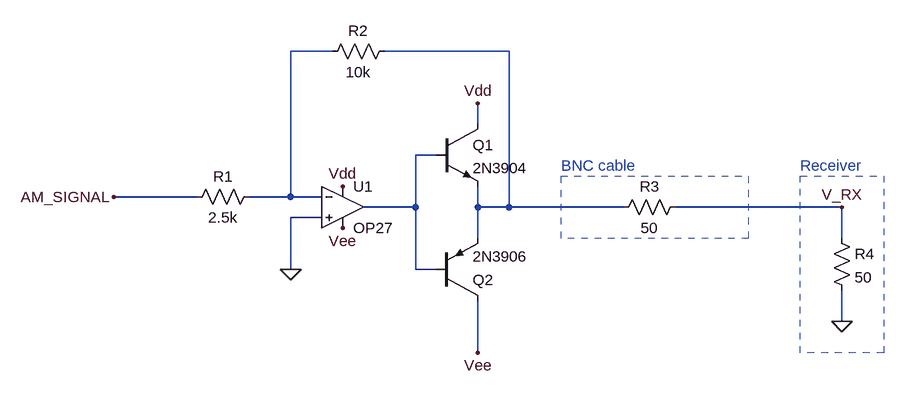
[diagram p0: schematic Draft6.asc]
Draft6.asc, the LTspice schematic file:
Version 4
SHEET 1 1012 680
WIRE 128 -128 64 -128
WIRE 400 -128 208 -128
WIRE 352 -16 352 -48
WIRE 288 32 256 32
WIRE -80 96 -208 96
WIRE 64 96 64 -128
WIRE 64 96 0 96
WIRE 112 96 64 96
WIRE 256 112 256 32
WIRE 256 112 176 112
WIRE 352 112 352 80
WIRE 400 112 400 -128
WIRE 400 112 352 112
WIRE 576 112 400 112
WIRE 912 112 656 112
WIRE 112 128 64 128
WIRE 352 160 352 112
WIRE 912 160 912 112
WIRE 64 208 64 128
WIRE 256 208 256 112
WIRE 288 208 256 208
WIRE 912 288 912 240
WIRE 352 336 352 256
FLAG -208 96 AM_SIGNAL
FLAG 144 80 Vdd
FLAG 352 -48 Vdd
FLAG 144 144 Vee
FLAG 352 336 Vee
FLAG 64 208 0
FLAG 912 288 0
FLAG 912 112 V_RX
SYMBOL res 16 80 R90
WINDOW 0 0 56 VBottom 2
WINDOW 3 32 56 VTop 2
SYMATTR InstName R1
SYMATTR Value 2.5k
SYMBOL res 224 -144 R90
WINDOW 0 0 56 VBottom 2
WINDOW 3 32 56 VTop 2
SYMATTR InstName R2
SYMATTR Value 10k
SYMBOL res 672 96 R90
WINDOW 0 0 56 VBottom 2
WINDOW 3 32 56 VTop 2
SYMATTR InstName R3
SYMATTR Value 50
SYMBOL res 896 144 R0
SYMATTR InstName R4
SYMATTR Value 50
SYMBOL Opamps\\OP27 144 48 R0
SYMATTR InstName U1
SYMBOL npn 288 -16 R0
SYMATTR InstName Q1
SYMATTR Value 2N3904
SYMBOL pnp 288 256 M180
SYMATTR InstName Q2
SYMATTR Value 2N3906
TEXT 480 48 Left 2 ;BNC cable
TEXT 848 48 Left 2 ;Receiver
RECTANGLE Normal 768 160 480 64 2
RECTANGLE Normal 976 336 848 64 2

The netlist it stands for:
* Draft6.asc
R1 N001 AM_SIGNAL 2.5k
R2 N002 N001 10k
R3 V_RX N002 50
R4 V_RX 0 50
XU1 0 N001 Vdd Vee N003 OP27  ; pins In+ In- V+ V- OUT
Q1 Vdd N003 N002 0 2N3904
Q2 Vee N003 N002 0 2N3906
.model NPN NPN
.model PNP PNP
.lib standard.bjt
* BNC cable
* Receiver
.lib ADI.lib
.backanno
.end